# Altium schematic sheet etapa6.SchDoc
size Letter
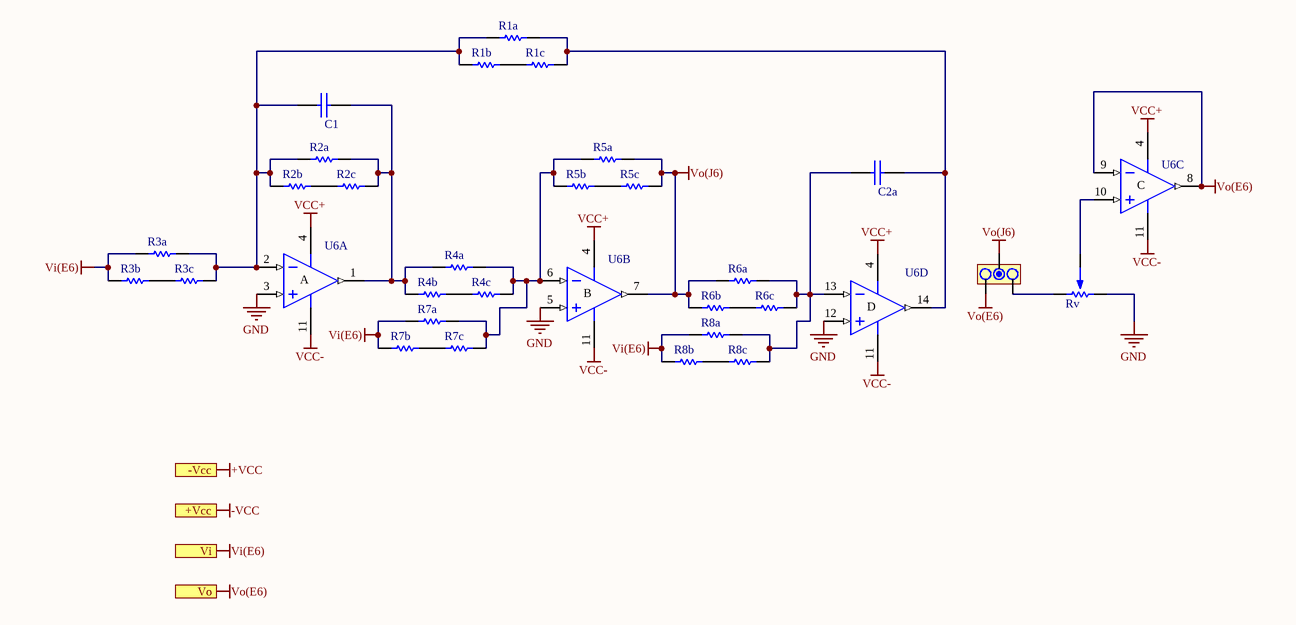
[diagram p0: etapa6.SchDoc]

## Parts
C1  CAP  [CAP200]  (value not drawn)
C2a  CAP  [CAP200]  (value not drawn)
Jumper?  JUMPER  [JUMPER3]  (value not drawn)
R1a  Res1  [AXIAL-0.3]  (value not drawn)
R1b  Res1  [AXIAL-0.3]  (value not drawn)
R1c  Res1  [AXIAL-0.3]  (value not drawn)
R2a  Res1  [AXIAL-0.3]  (value not drawn)
R2b  Res1  [AXIAL-0.3]  (value not drawn)
R2c  Res1  [AXIAL-0.3]  (value not drawn)
R3a  Res1  [AXIAL-0.3]  (value not drawn)
R3b  Res1  [AXIAL-0.3]  (value not drawn)
R3c  Res1  [AXIAL-0.3]  (value not drawn)
R4a  Res1  [AXIAL-0.3]  (value not drawn)
R4b  Res1  [AXIAL-0.3]  (value not drawn)
R4c  Res1  [AXIAL-0.3]  (value not drawn)
R5a  Res1  [AXIAL-0.3]  (value not drawn)
R5b  Res1  [AXIAL-0.3]  (value not drawn)
R5c  Res1  [AXIAL-0.3]  (value not drawn)
R6a  Res1  [AXIAL-0.3]  (value not drawn)
R6b  Res1  [AXIAL-0.3]  (value not drawn)
R6c  Res1  [AXIAL-0.3]  (value not drawn)
R7a  Res1  [AXIAL-0.3]  (value not drawn)
R7b  Res1  [AXIAL-0.3]  (value not drawn)
R7c  Res1  [AXIAL-0.3]  (value not drawn)
R8a  Res1  [AXIAL-0.3]  (value not drawn)
R8b  Res1  [AXIAL-0.3]  (value not drawn)
R8c  Res1  [AXIAL-0.3]  (value not drawn)
Rv  PRESET  [PRESET H]  (value not drawn)
U6  TL084N  [N014]  (value not drawn)  (parts A,B,C,D of 4)

## Ports
+Vcc, -Vcc, Vi, Vo

## Nets
+VCC: port -Vcc
-VCC: port +Vcc
GND: Rv.3 U6.3(IN+) U6.5(IN+) U6.12(IN+)
VCC+: U6.4(V+)
VCC-: U6.11(V-)
Vi(E6): R3a.1 R3b.1 R7a.1 R7b.1 R8a.1 R8b.1 ; port Vi
Vo(E6): Jumper?.3 U6.8(OUT) U6.9(IN-) ; port Vo
Vo(J6): Jumper?.2 R5a.2 R5c.2 R6a.1 R6b.1 U6.7(OUT)
NetC1_1: C1.1 R1a.1 R1b.1 R2a.1 R2b.1 R3a.2 R3c.2 U6.2(IN-)
NetC1_2: C1.2 R2a.2 R2c.2 R4a.1 R4b.1 U6.1(OUT)
NetC2a_1: C2a.1 R6a.2 R6c.2 R8a.2 R8c.2 U6.13(IN-)
NetC2a_2: C2a.2 R1a.2 R1c.2 U6.14(OUT)
NetJumper?_1: Jumper?.1 Rv.1
NetR1b_2: R1b.2 R1c.1
NetR2b_2: R2b.2 R2c.1
NetR3b_2: R3b.2 R3c.1
NetR4a_2: R4a.2 R4c.2 R5a.1 R5b.1 R7a.2 R7c.2 U6.6(IN-)
NetR4b_2: R4b.2 R4c.1
NetR5b_2: R5b.2 R5c.1
NetR6b_2: R6b.2 R6c.1
NetR7b_2: R7b.2 R7c.1
NetR8b_2: R8b.2 R8c.1
NetRv_2: Rv.2 U6.10(IN+)

## Notes on the sheet
- (in symbol TL084N, part A) A
- (in symbol TL084N, part B) B
- (in symbol TL084N, part C) C
- (in symbol TL084N, part D) D

## Library data of the parts
Jumper? = JUMPER3
R1a R1b R1c R2a R2b R2c R3a R3b R3c R4a R4b R4c R5a R5b R5c R6a R6b R6c R7a R7b R7c R8a R8b R8c = Res1: Resistor; Published: 8-Jun-2000; LatestRevisionDate: 17-Jul-2002; LatestRevisionNote: Re-released for DXP Platform.; PackageReference: AXIAL-0.3; Publisher: Altium Limited; PackageDescription: Axial Device, Thru-Hole; 2 Leads; 0.3 in Pin Spacing
U6 = TL084N: JFET-Input Operational Amplifier; Published: 16-Jan-2001; LatestRevisionDate: 04-Mar-2005; LatestRevisionNote: Stylized 3D Model Added.; DatasheetVersion: Feb-1999; PackageVersion: Oct-1995; PackageReference: N014; Publisher: Altium Limited; PackageDescription: DIP; 14 Leads; Row Spacing 7.62 mm; Pitch 2.54 mm; ComponentLink1Description: Manufacturer Link; ComponentLink1URL: http://www.ti.com/; ComponentLink2Description: Datasheet; ComponentLink2URL: http://www-s.ti.com/sc/ds/tl084.pdf